# EAGLE design TPS7A47_module_A (EAGLE 7.6.0)
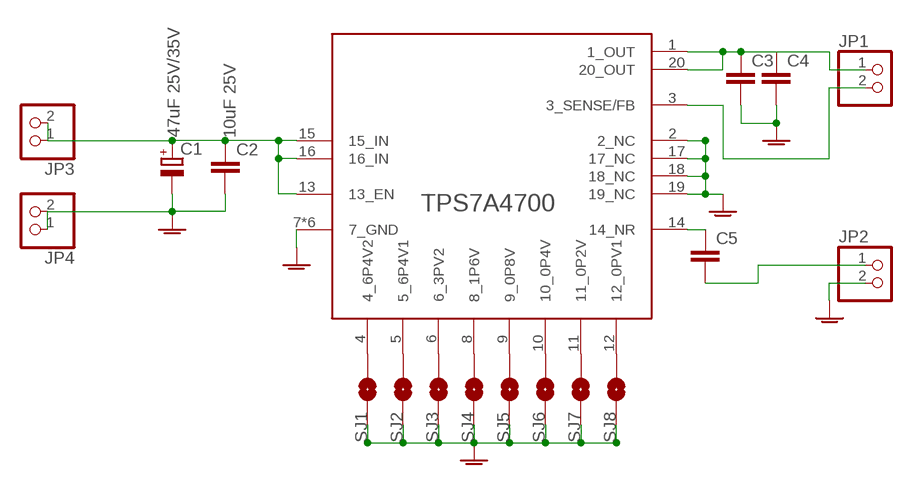
[diagram p0: schematic, sheet 1]

## Parts
C1  47uF 25V/35V  CPOL-EUD/7343-31R  [D/7343-31R]
C2  10uF 25V  C-EUC0805K  [C0805K]
C3  C-EUC1206  [C1206]
C4  C-EUC1206  [C1206]
C5  C-EUC0805  [C0805]
IC  TPS7A4701  [VQFN20]
JP1  PINHD-1X2  [1X02]
JP2  PINHD-1X2  [1X02]
JP3  PINHD-1X2  [1X02]
JP4  PINHD-1X2  [1X02]
SJ1  SOLDERJUMPERNO  [SJ_2S-NO]
SJ2  SOLDERJUMPERNO  [SJ_2S-NO]
SJ3  SOLDERJUMPERNO  [SJ_2S-NO]
SJ4  SOLDERJUMPERNO  [SJ_2S-NO]
SJ5  SOLDERJUMPERNO  [SJ_2S-NO]
SJ6  SOLDERJUMPERNO  [SJ_2S-NO]
SJ7  SOLDERJUMPERNO  [SJ_2S-NO]
SJ8  SOLDERJUMPERNO  [SJ_2S-NO]

## Nets
GND: C1.- C2.2 C3.2 C4.2 IC.2(2_NC) IC.7(7_GND) IC.17(17_NC) IC.18(18_NC) IC.19(19_NC) IC.21(7_GND) IC.P$1(7_GND) IC.P$2(7_GND) IC.P$3(7_GND) IC.P$4(7_GND) JP2.2 JP4.1 JP4.2 SJ1.1 SJ2.1 SJ3.1 SJ4.1 SJ5.1 SJ6.1 SJ7.1 SJ8.1
IN+: C1.+ C2.1 IC.13(13_EN) IC.15(15_IN) IC.16(16_IN) JP3.1 JP3.2
N$1: IC.4(4_6P4V2) SJ1.2
N$2: IC.5(5_6P4V1) SJ2.2
N$3: C5.2 JP2.1
N$4: C5.1 IC.14(14_NR)
N$6: IC.6(6_3PV2) SJ3.2
N$7: IC.8(8_1P6V) SJ4.2
N$8: IC.9(9_0P8V) SJ5.2
N$9: IC.10(10_0P4V) SJ6.2
N$10: IC.11(11_0P2V) SJ7.2
N$11: IC.12(12_0PV1) SJ8.2
N$12: IC.3(3_SENSE/FB) JP1.2
OUT+: C3.1 C4.1 IC.1(1_OUT) IC.20(20_OUT) JP1.1

## Library data of the parts
C1 = resistor:CPOL-EU: POLARIZED CAPACITOR, European symbol
C2-C5 = resistor:C-EU: CAPACITOR, European symbol
IC = TI_reg_lib_v2:TPS7A4701
JP1-JP4 = pinhead:PINHD-1X2: PIN HEADER
SJ1-SJ8 = sparkfun:SOLDERJUMPER: Solder Jumper Standard SMD solder jumper. Used to automate production. Two varients : Normally Open and Normally Closed are the same, but have different paste layers. NC will have a large amount of paste and should jumper during reflow.

## Board
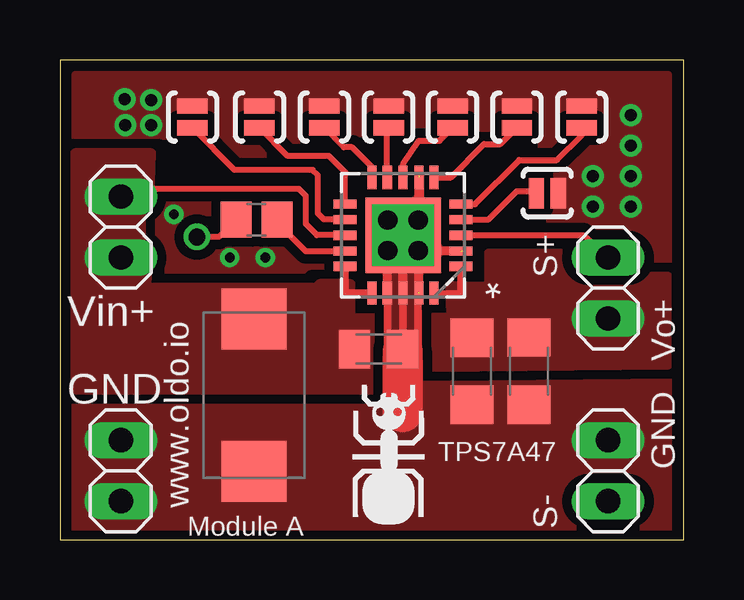
[diagram p1: board, top side]
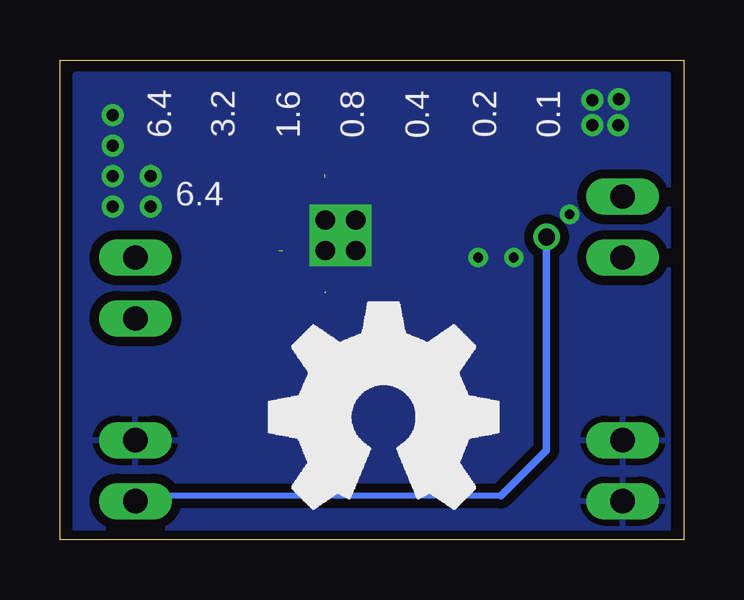
[diagram p2: board, bottom side, seen from below]

Size 26 x 20 mm. Coordinates in mm from the lower left corner, seen from the top.
Outline: 0,0 26,0 26,20 0,20 0,0
Copper layers (1*16): Top 0.035mm / dielectric 1.5mm / Bottom 0.035mm
Design rules "default *": minimum track width 10mil, minimum drill 24mil, track to track 15mil, track to pad 15mil, pad to pad 12mil, via to via 12mil, smd to smd 8mil, copper to edge 15mil, drill to drill 8mil, minimum pad ring 10mil, minimum via ring 8mil, stop-mask expansion 4mil, vias tented up to drill 20mil, thermal gap 10mil

### Footprints (pad centres in the part's own frame; a part is rotated, then mirrored left to right if it is on the bottom)
D/7343-31R = smd 2.55 x 2.7: + 3.175,0; - -3.175,0
C0805K = smd 1.3 x 1.6: 1 -1,0; 2 1,0
C1206 = smd 1.6 x 1.8: 1 -1.4,0; 2 1.4,0
C0805 = smd 1.3 x 1.5: 1 -0.85,0; 2 0.85,0
VQFN20 = smd 0.965 x 0.381: 1 -2.413,1.295; 2 -2.413,0.66; 3 -2.413,0; 4 -2.413,-0.66; 5 -2.413,-1.295; 11 2.413,-1.295; 12 2.413,-0.66; 13 2.413,0; 14 2.413,0.66; 15 2.413,1.295 | smd 0.381 x 0.965: 6 -1.295,-2.413; 7 -0.66,-2.413; 8 0,-2.413; 9 0.66,-2.413; 10 1.295,-2.413; 16 1.295,2.413; 17 0.66,2.413; 18 0,2.413; 19 -0.66,2.413; 20 -1.295,2.413 | smd 3.15 x 3.15: 21 0,0 | drill 0.8 square: P$1 -0.635,0.635; P$2 0.635,0.635; P$3 0.635,-0.635; P$4 -0.635,-0.635
1X02 = drill 1.016 long: 1 -1.27,0; 2 1.27,0
SJ_2S-NO = smd 0.635 x 1.27: 1 -0.45,0; 2 0.45,0

### Placement (x,y rotation side)
C1  8.09,6.02 90 top
C2  13.28,7.94 0 top
C3  19.55,7.03 270 top
C4  17.18,7.02 270 top
C5  8.2,13.34 180 top
IC  14.31,12.69 180 top
JP1  22.85,10.49 90 top
JP2  22.85,2.87 90 top
JP3  2.53,13.03 90 top
JP4  2.53,2.87 90 top
SJ1  20.32,14.44 180 top
SJ2  21.75,17.62 270 top
SJ3  19.05,17.62 270 top
SJ4  16.37,17.62 270 top
SJ5  13.7,17.62 270 top
SJ6  11.02,17.62 270 top
SJ7  8.32,17.62 270 top
SJ8  5.52,17.62 270 top

### Tracks (layer width: path | path; a pad name or v marks a point on that pad's centre or on a via)
GND  (via drill 0.4, 0.5)  (3 unrouted)
  Top 0.305: 14.93,10.33 14.97,10.33 | IC.17 13.65,8.17 | IC.19 14.92,10.28 14.92,8.17 | C2.2 14.3,7.94 IC.18
  Top 0.38: 13.65,10.14 13.65,11.99 | IC.18 14.31,11.42 | 14.97,10.14 14.97,12.03 16.87,12.03
  Top 0.406: 14.31,11.42 13.69,12.05 | 14.99,12.05 14.97,12.03 14.96,12.05 | 14.98,15.22 14.98,13.36 14.96,13.34 | IC.P$2 13.75,12.04 14.36,12.65 | SJ2.1 | SJ3.1 | SJ4.1 | SJ5.1
  Top 1.676: 14.28,7.85 14.28,5.31
  other vias: 3.8,17.28 2.73,17.28 22.22,15.16 23.81,15.16 23.81,16.43 23.81,17.7 23.81,13.89 22.22,13.89 4.76,13.57 3.8,18.33 2.69,18.36 8.57,11.76 7.08,11.76
  pour Bottom (isolate 0.254): 0.63,19.38 25.36,19.38 25.36,0.33 0.63,0.33
  pour Top (rank 4, no thermals): 0.63,0.33 25.36,0.33 25.36,19.38 0.63,19.38
  pour Top: 4.12,14.84 4.12,11.66 7.3,11.66 7.3,13.89 9.52,13.89 9.52,14.84
IN+
  Top 0.254: IC.13 10.72,12.69 10.25,13.16 10.25,14.33 9.96,14.62 2.95,14.62 JP3.2 3.36,14.9
  Top 0.305: IC.16 11.87,10.28 11.87,10.24 11.89,10.24 IC.15
  pour Top (rank 2, no thermals): 10.82,10.65 10.63,10.49 3.61,10.49 3.8,16.11 0.63,16.11 0.63,6.27 14.5,6.27 14.5,9.22 12.12,9.22 12.12,10.65
N$1
  Top 0.254: IC.4 17.87,13.35 19.05,14.52 19.79,14.52 SJ1.2
N$2
  Top 0.254: IC.5 17.31,13.98 19.15,15.82 20.73,15.82 21.75,16.85 SJ2.2
N$3  (via drill 0.7)
  Top 0.254: C5.2 6.63,12.62 v5.71,12.62
  Bottom 0.254: 7.62,1.82 22.54,1.82 JP2.1
  Bottom 0.305: v5.71,12.62 5.71,3.73 7.62,1.82
N$4
  Top 0.254: IC.14 11.88,12.01 10.25,12.01 9.05,13.21 C5.1
N$6
  Top 0.254: IC.6 16.29,15.1 17.68,16.49 18.37,16.49 SJ3.2 18.95,17.07
N$7
  Top 0.254: IC.8 14.3,15.65 14.96,16.63 15.83,16.63 SJ4.2
N$8
  Top 0.254: IC.9 13.64,17.11 SJ5.2
N$9
  Top 0.254: IC.10 13.01,15.54 12.18,16.36 11.83,16.36 SJ6.2
N$10
  Top 0.254: IC.11 11.89,15.31 11.21,16 9.49,16 SJ7.2
N$11
  Top 0.254: IC.12 11.01,13.35 10.76,13.6 10.76,15.19 10.54,15.41 7.28,15.41 SJ8.2
N$12
  Top 0.254: IC.3 21.83,12.69 JP1.2
OUT+
  Top 0.305: IC.1 16.73,10.24 15.6,10.24 IC.20
  pour Top (no thermals): 15.52,9.31 15.52,7.12 25.39,7.22 25.39,11.03 22.22,11.03 22.22,11.98 17.81,11.98 17.81,10.62 16.19,10.65 16.22,9.31

### Text on the board
tPlace: S+ | Vin+ | Vo+ | GND | TPS7A47 | GND | www.oldo.io | Module A | S-
bPlace: 0.1 | 0.2 | 0.4 | 0.8 | 1.6 | 3.2 | 6.4 | 6.4